# EAGLE design ArduEye (EAGLE 5.08)
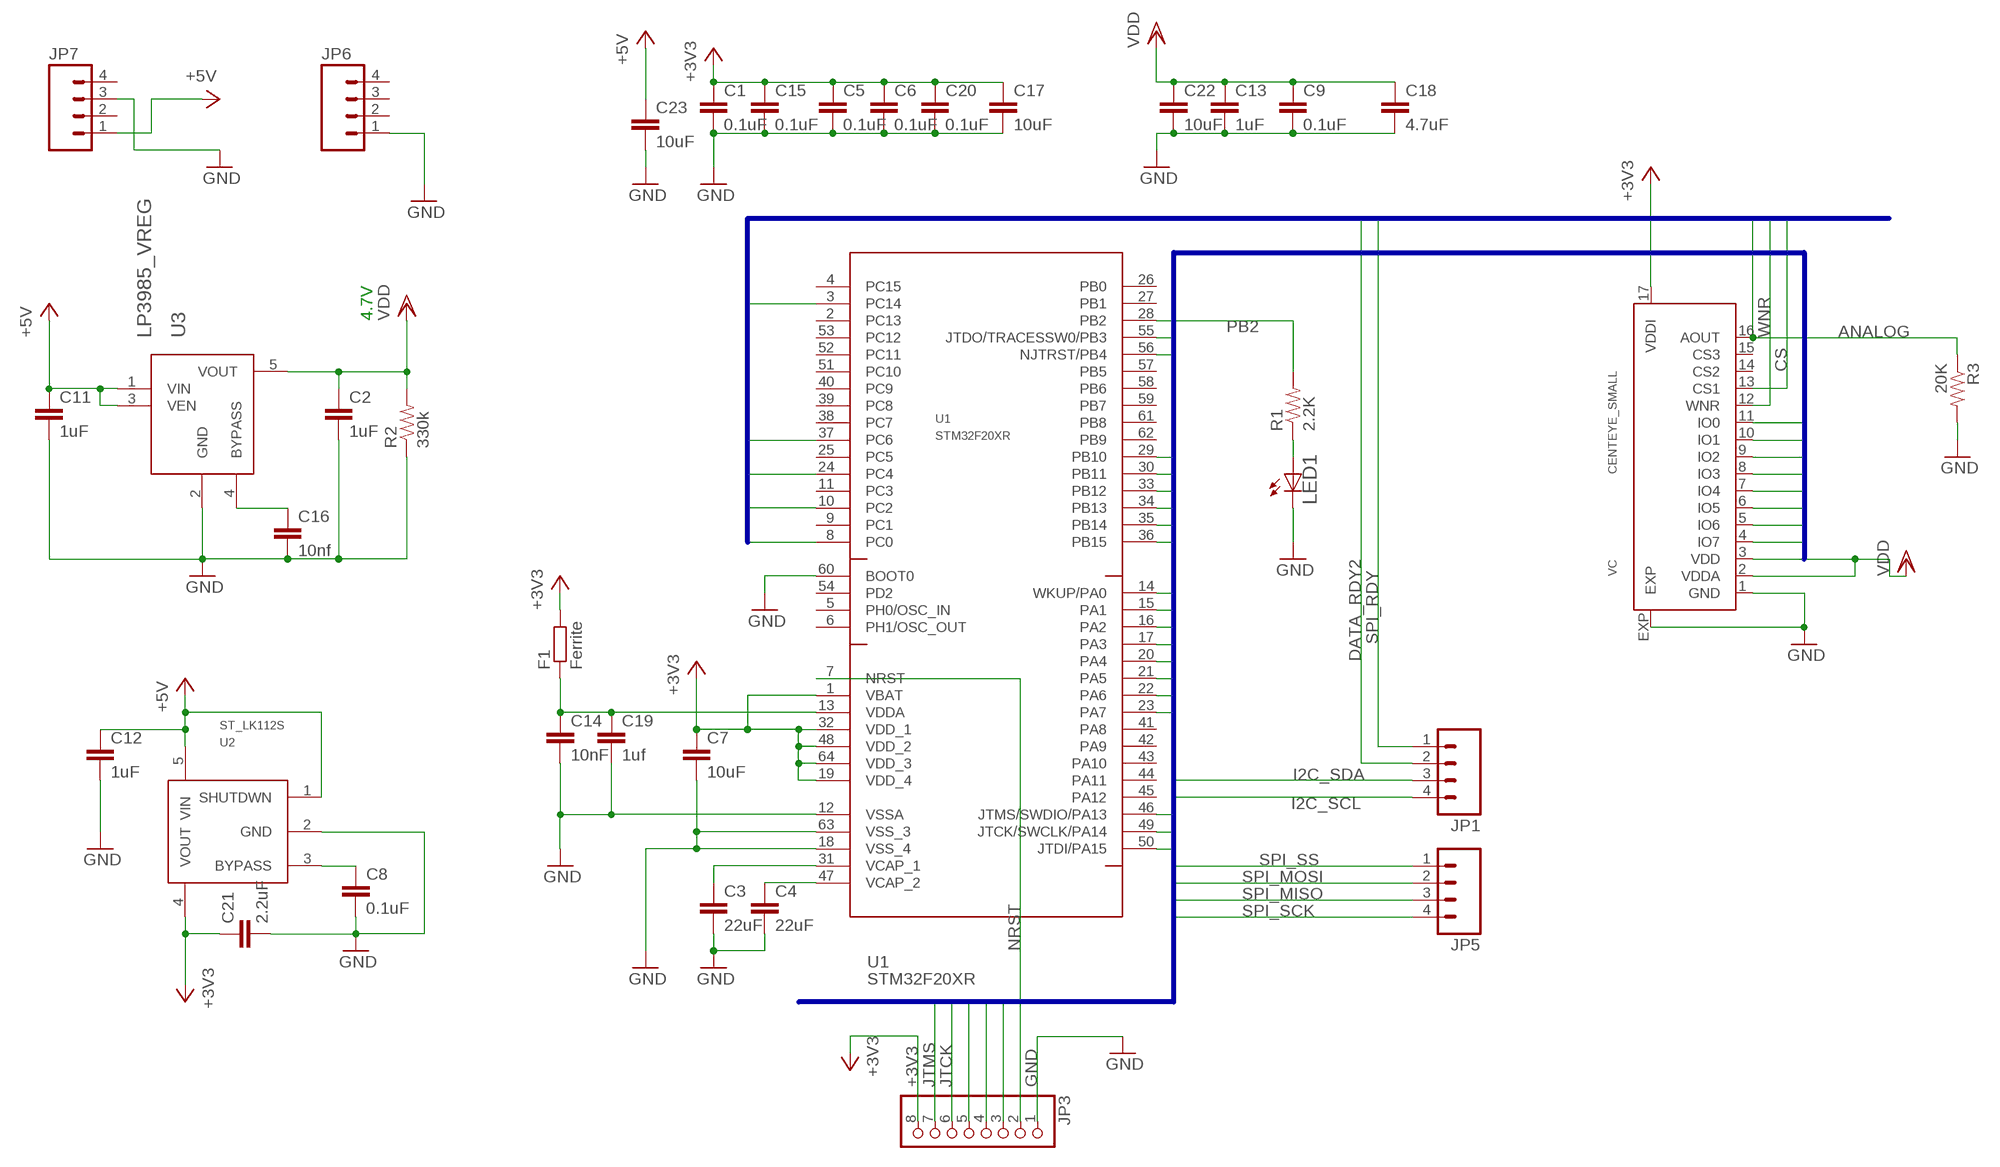
[diagram p0: schematic, sheet 1]

## Parts
C1  0.1uF  CAP0402-CAP  [0402-CAP]
C2  1uF  CAP0402-CAP  [0402-CAP]
C3  22uF  CAP0603-CAP  [0603-CAP]
C4  22uF  CAP0603-CAP  [0603-CAP]
C5  0.1uF  CAP0402-CAP  [0402-CAP]
C6  0.1uF  CAP0402-CAP  [0402-CAP]
C7  10uF  CAP0603-CAP  [0603-CAP]
C8  0.1uF  CAP0402-CAP  [0402-CAP]
C9  0.1uF  CAP0402-CAP  [0402-CAP]
C11  1uF  CAP0402-CAP  [0402-CAP]
C12  1uF  CAP0402-CAP  [0402-CAP]
C13  1uF  CAP0402-CAP  [0402-CAP]
C14  10nF  CAP0402-CAP  [0402-CAP]
C15  0.1uF  CAP0402-CAP  [0402-CAP]
C16  10nf  CAP0603-CAP  [0603-CAP]
C17  10uF  CAP0603-CAP  [0603-CAP]
C18  4.7uF  CAP0402-CAP  [0402-CAP]
C19  1uf  CAP0402-CAP  [0402-CAP]
C20  0.1uF  CAP0402-CAP  [0402-CAP]
C21  2.2uF  CAP0402-CAP  [0402-CAP]
C22  10uF  CAP0603-CAP  [0603-CAP]
C23  10uF  CAP0603-CAP  [0603-CAP]
F1  Ferrite  R-EU_R0402  [R0402]
JP1  M04PTH  [1X04]
JP3  PINHD-1X8/2MM  [1X08/2MM]
JP5  M04PTH  [1X04]
JP6  M04PTH  [1X04]
JP7  M04PTH  [1X04]
LED1  LEDCHIPLED_0805  [CHIPLED_0805]
R1  2.2K  RESISTOR0402-RES  [0402-RES]
R2  330k  RESISTOR0402-RES  [0402-RES]
R3  20K  RESISTOR0402-RES  [0402-RES]
U1  STM32F20XR  [LQFP64]
U2  ST_LK112S  [SOT23-5L]
U3  LP3985_VREG  [SOT-235]
VC  CENTEYE_SMALL  [CENTEYE_SMALL]

## Nets
+3V3: C1.1 C5.1 C6.1 C7.1 C15.1 C17.1 C20.1 C21.1 F1.2 JP3.8 U1.1(VBAT) U1.19(VDD_4) U1.32(VDD_1) U1.48(VDD_2) U1.64(VDD_3) U2.4(VOUT) VC.17(VDDI)
+5V: C11.1 C12.1 C23.1 JP7.1 U2.1(SHUTDWN) U2.5(VIN) U3.1(VIN) U3.3(VEN)
ANALOG: R3.1 U1.10(PC2) VC.16(AOUT)
CS: U1.8(PC0) VC.13(CS1)
DATA_RDY2: JP1.2 U1.24(PC4)
GND: C1.2 C2.2 C3.2 C4.2 C5.2 C6.2 C7.2 C8.2 C9.2 C11.2 C12.2 C13.2 C14.2 C15.2 C16.2 C17.2 C18.2 C19.2 C20.2 C21.2 C22.2 C23.2 JP3.1 JP6.1 JP7.3 LED1.C R2.1 R3.2 U1.12(VSSA) U1.18(VSS_4) U1.60(BOOT0) U1.63(VSS_3) U2.2(GND) U3.2(GND) VC.1(GND) VC.EXP
I2C_SCL: JP1.4 U1.29(PB10)
I2C_SDA: JP1.3 U1.30(PB11)
IO0: U1.14(WKUP/PA0) VC.11(IO0)
IO1: U1.15(PA1) VC.10(IO1)
IO2: U1.16(PA2) VC.9(IO2)
IO3: U1.17(PA3) VC.8(IO3)
IO4: U1.20(PA4) VC.7(IO4)
IO5: U1.21(PA5) VC.6(IO5)
IO6: U1.22(PA6) VC.5(IO6)
IO7: U1.23(PA7) VC.4(IO7)
JTCK: JP3.6 U1.49(JTCK/SWCLK/PA14)
JTDI: JP3.5 U1.50(JTDI/PA15)
JTDO: JP3.4 U1.55(JTDO/TRACESSW0/PB3)
JTMS: JP3.7 U1.46(JTMS/SWDIO/PA13)
N$1: C3.1 U1.31(VCAP_1)
N$2: C4.1 U1.47(VCAP_2)
N$7: C16.1 U3.4(BYPASS)
N$8: C8.1 U2.3(BYPASS)
N$13: C14.1 C19.1 F1.1 U1.13(VDDA)
N$15: LED1.A R1.1
NJTRST: JP3.3 U1.56(NJTRST/PB4)
NRST: JP3.2 U1.7(NRST)
PB2: R1.2 U1.28(PB2)
SPI_MISO: JP5.3 U1.35(PB14)
SPI_MOSI: JP5.2 U1.36(PB15)
SPI_RDY: JP1.1 U1.37(PC6)
SPI_SCK: JP5.4 U1.34(PB13)
SPI_SS: JP5.1 U1.33(PB12)
VDD: C2.1 C9.1 C13.1 C18.1 C22.1 R2.2 U3.5(VOUT) VC.2(VDDA) VC.3(VDD)
WNR: U1.3(PC14) VC.12(WNR)
Unconnected: JP6.2 JP6.3 JP6.4 JP7.2 JP7.4 U1.2(PC13) U1.4(PC15) U1.5(PH0/OSC_IN) U1.6(PH1/OSC_OUT) U1.9(PC1) U1.11(PC3) U1.25(PC5) U1.26(PB0) U1.27(PB1) U1.38(PC7) U1.39(PC8) U1.40(PC9) U1.41(PA8) U1.42(PA9) U1.43(PA10) U1.44(PA11) U1.45(PA12) U1.51(PC10) U1.52(PC11) U1.53(PC12) U1.54(PD2) U1.57(PB5) U1.58(PB6) U1.59(PB7) U1.61(PB8) U1.62(PB9) VC.14(CS2) VC.15(CS3)

## Buses
JTMS,JTCK,JTDI,IO[0..7],JTDO,NJTRST,SPI_MISO,SPI_MOSI,SPI_SS,SPI_SCK,PB2,I2C_SCL,I2C_SDA
CS,WNR,DATA_RDY2,SPI_RDY,ANALOG

## Notes on the sheet
- 4.7V

## Library data of the parts
C1-C9 C11-C23 = SparkFun:CAP: Capacitor Standard 0603 ceramic capacitor, and 0.1" leaded capacitor.
F1 = rcl:R-EU_: RESISTOR, European symbol
JP1 JP5-JP7 = SparkFun:M04: Header 4 Standard 4-pin 0.1" header. Use with straight break away headers (SKU : PRT-00116), right angle break away headers (PRT-00553), swiss pins (PRT-00743), machine pins (PRT-00117), and female headers (PRT-00115). Molex polarized connector foot print use with SKU : PRT-08231 with associated crimp pins and housings. 1MM SMD Version SKU: PRT-10208
JP3 = pinhead:PINHD-1X8: PIN HEADER
LED1 = led:LED: LED OSRAM: - CHIPLED LG R971, LG N971, LY N971, LG Q971, LY Q971, LO R971, LY R971 LH N974, LH R974 LS Q976, LO Q976, LY Q976 LO Q996 - Hyper CHIPLED LW Q18S LB Q993, LB Q99A, LB R99A - SideLED LS A670, LO A670, LY A670, LG A670, LP A670 LB A673, LV A673, LT A673, LW A673 LH A674 LY A675 LS A676, LA A676, LO A676, LY A676, LW A676 LS A679, LY A679, LG A679 - Hyper Micro SIDELED® LS Y876, LA Y876, LO Y876, LY Y876 LT Y87S - SmartLED LW L88C, LW L88S LB L89C, LB L89S, LG L890 LS L89K, LO L89K, LY L89K LS L896, LA L896, LO L896, LY L896 - TOPLED LS T670, LO T670, LY T670, LG T670, LP T670 LSG T670, LSP T670, LSY T670, LOP T670, LYG T670 LG T671, LOG T671, LSG T671 LB T673, LV T673, LT T673, LW T673 LH T674 LS T676, LA T676, LO T676, LY T676, LB T676, LH T676, LSB T676, LW T676 LB T67C, LV T67C, LT T67C, LS T67K, LO T67K, LY T67K, LW E67C LS E67B, LA E67B, LO E67B, LY E67B, LB E67C, LV E67C, LT E67C LW T67C LS T679, LY T679, LG T679 LS T770, LO T770, LY T770, LG T770, LP T770 LB T773, LV T773, LT T773, LW T773 LH T774 LS E675, LA E675, LY E675, LS T675 LS T776, LA T776, LO T776, LY T776, LB T776 LHGB T686 LT T68C, LB T68C - Hyper Mini TOPLED® LB M676 - Mini TOPLED Santana® LG M470 LS M47K, LO M47K, LY M47K Source: http://www.osram.convergy.de LUXEON: - LUMILED® LXK2-PW12-R00, LXK2-PW12-S00, LXK2-PW14-U00, LXK2-PW14-V00 LXK2-PM12-R00, LXK2-PM12-S00, LXK2-PM14-U00 LXK2-PE12-Q00, LXK2-PE12-R00, LXK2-PE12-S00, LXK2-PE14-T00, LXK2-PE14-U00 LXK2-PB12-K00, LXK2-PB12-L00, LXK2-PB12-M00, LXK2-PB14-N00, LXK2-PB14-P00, LXK2-PB14-Q00 LXK2-PR12-L00, LXK2-PR12-M00, LXK2-PR14-Q00, LXK2-PR14-R00 LXK2-PD12-Q00, LXK2-PD12-R00, LXK2-PD12-S00 LXK2-PH12-R00, LXK2-PH12-S00 LXK2-PL12-P00, LXK2-PL12-Q00, LXK2-PL12-R00 Source: www.luxeon.com KINGBRIGHT: KA-3528ASYC Source: www.kingbright.com
R1-R3 = SparkFun:RESISTOR: Resistor Basic schematic elements and footprints for 0603, 1206, and PTH resistors.
U1 = stm32F:STM32F20XR
U2 = VREGS:ST_LK112S
U3 = national-semiconductor:LP3985_VREG
VC = ty_custom2:CENTEYE_SMALL

## Board
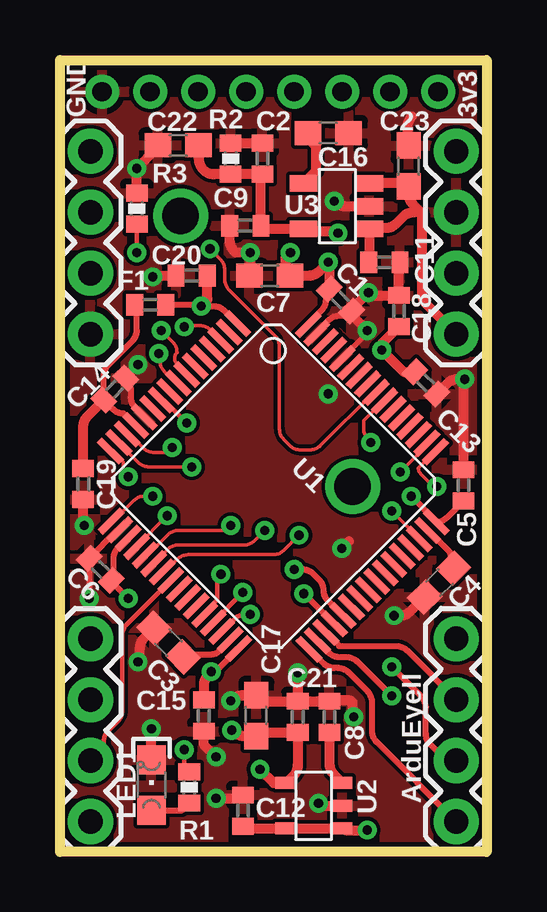
[diagram p1: board, top side]
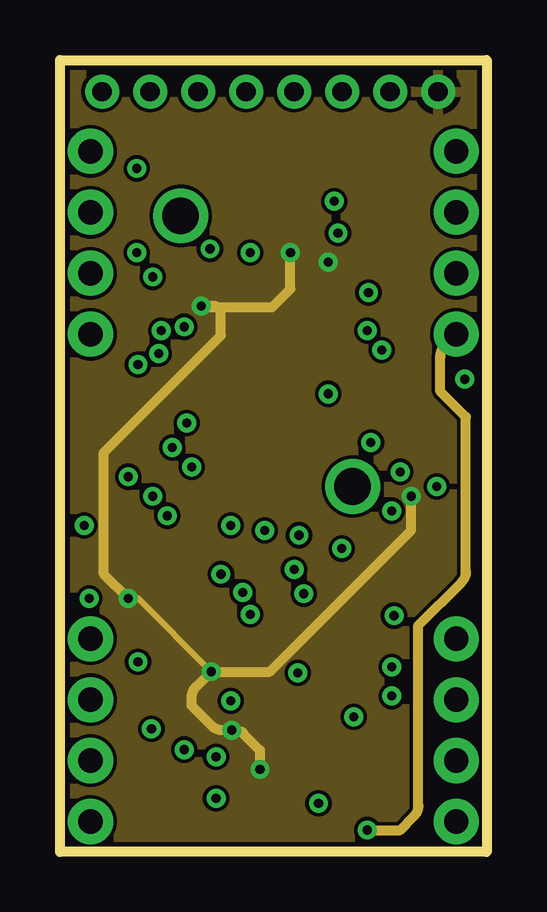
[diagram p2: board, inner layer Route2]
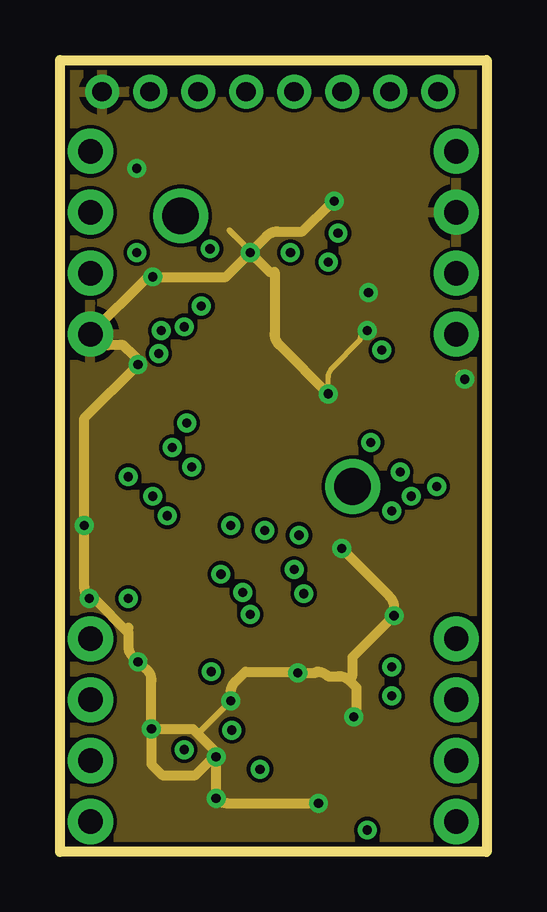
[diagram p3: board, inner layer Route15]
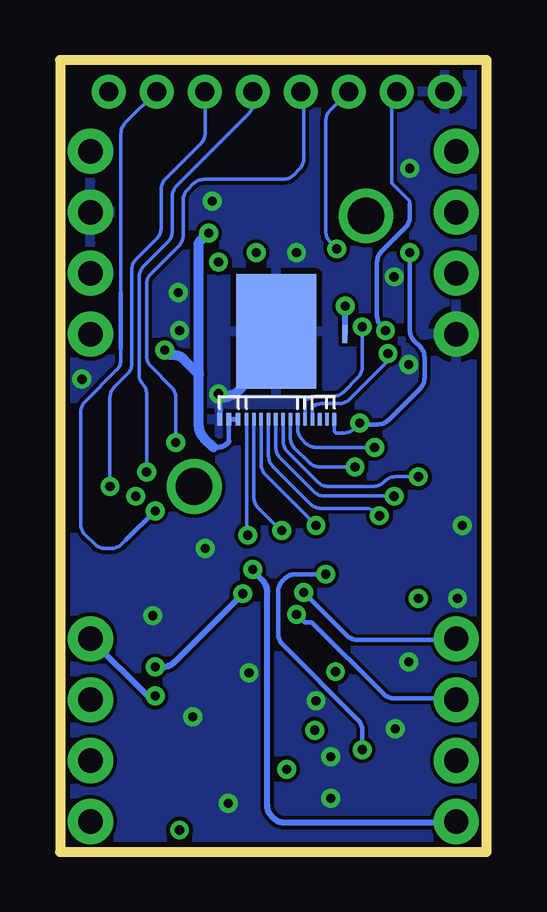
[diagram p4: board, bottom side, seen from below]

Size 17.78 x 33.02 mm. Coordinates in mm from the lower left corner, seen from the top.
Outline: 0,0 0,33.02 17.78,33.02 17.78,0 0,0
Copper layers (1*2*15*16): Top 0.035mm / dielectric 0.2mm / Route2 0.035mm / dielectric 0.2mm / Route15 0.035mm / dielectric 0.2mm / Bottom 0.035mm
Design rules "default *": minimum track width 6mil, minimum drill 15mil, track to track 6mil, track to pad 6mil, pad to pad 6mil, via to via 6mil, smd to smd 0mil, copper to edge 8mil, drill to drill 8mil, minimum pad ring 10mil, minimum via ring 8mil, stop-mask expansion 4mil, vias tented up to drill 20mil, thermal gap 10mil

### Footprints (pad centres in the part's own frame; a part is rotated, then mirrored left to right if it is on the bottom)
0402-CAP = smd 0.7 x 0.9: 1 -0.65,0; 2 0.65,0
0603-CAP = smd 1.1 x 1: 1 -0.85,0; 2 0.85,0
R0402 = smd 0.7 x 0.9: 1 -0.65,0; 2 0.65,0
1X04 = drill 1.016 pad 1.88 round: 1 0,0; 2 2.54,0; 3 5.08,0; 4 7.62,0
1X08/2MM = drill 0.8 pad 1.422 round: 1 -8,0; 2 -6,0; 3 -4,0; 4 -2,0; 5 0,0; 6 2,0; 7 4,0; 8 6,0
CHIPLED_0805 = smd 1.2 x 1.2: A 0,-1.05; C 0,1.05
0402-RES = smd 0.7 x 0.9: 1 -0.65,0; 2 0.65,0
LQFP64 = smd 1.3 x 0.3: 1 -5.85,3.75; 2 -5.85,3.25; 3 -5.85,2.75; 4 -5.85,2.25; 5 -5.85,1.75; 6 -5.85,1.25; 7 -5.85,0.75; 8 -5.85,0.25; 9 -5.85,-0.25; 10 -5.85,-0.75; 11 -5.85,-1.25; 12 -5.85,-1.75; 13 -5.85,-2.25; 14 -5.85,-2.75; 15 -5.85,-3.25; 16 -5.85,-3.75; 33 5.85,-3.75; 34 5.85,-3.25; 35 5.85,-2.75; 36 5.85,-2.25; 37 5.85,-1.75; 38 5.85,-1.25; 39 5.85,-0.75; 40 5.85,-0.25; 41 5.85,0.25; 42 5.85,0.75; 43 5.85,1.25; 44 5.85,1.75; 45 5.85,2.25; 46 5.85,2.75; 47 5.85,3.25; 48 5.85,3.75 | smd 0.3 x 1.3: 17 -3.75,-5.8; 18 -3.25,-5.8; 19 -2.75,-5.8; 20 -2.25,-5.8; 21 -1.75,-5.8; 22 -1.25,-5.8; 23 -0.75,-5.8; 24 -0.25,-5.8; 25 0.25,-5.8; 26 0.75,-5.8; 27 1.25,-5.8; 28 1.75,-5.8; 29 2.25,-5.8; 30 2.75,-5.8; 31 3.25,-5.8; 32 3.75,-5.8; 49 3.75,5.8; 50 3.25,5.8; 51 2.75,5.8; 52 2.25,5.8; 53 1.75,5.8; 54 1.25,5.8; 55 0.75,5.8; 56 0.25,5.8; 57 -0.25,5.8; 58 -0.75,5.8; 59 -1.25,5.8; 60 -1.75,5.8; 61 -2.25,5.8; 62 -2.75,5.8; 63 -3.25,5.8; 64 -3.75,5.8
SOT23-5L = smd 0.5 x 0.8: 1 0.95,1.15; 2 0,1.15; 3 -0.95,1.15; 4 -0.95,-1.25; 5 0.95,-1.25
SOT-235 = smd 0.686 x 1.143: 1 -0.953,-0.953; 2 0,-0.953; 3 0.953,-0.953; 4 0.953,1.791; 5 -0.953,1.791
CENTEYE_SMALL = smd 0.203 x 0.508: 1 -1.981,-1.01; 2 -1.6,-1.008; 3 -1.219,-1.008 | smd 0.152 x 0.508: 4 -0.864,-1.008; 5 -0.559,-1.008; 6 -0.254,-1.008; 7 0.051,-1.008; 8 0.356,-1.008; 9 0.66,-1.008; 10 0.965,-1.008; 11 1.27,-1.005; 12 1.575,-1.008; 13 1.88,-1.008; 14 2.184,-1.008; 15 2.489,-1.007; 16 2.794,-1.007 | smd 0.203 x 0.762: 17 3.229,2.546 | smd 3.327 x 4.775: EXP 0.381,2.654

### Placement (x,y rotation side)
C1  11.68,23.01 315 top
C2  8.43,28.91 90 top
C3  4.52,8.74 135 top
C4  15.8,11.23 225 top
C5  16.81,15.29 90 top
C6  1.68,11.79 135 top
C7  8.74,24.03 180 top
C8  11.23,5.64 90 top
C9  7.72,26.11 180 top
C11  13.51,24.59 0 top
C12  7.62,1.73 90 top
C13  15.24,19.56 315 top
C14  2.29,19.3 45 top
C15  5.99,5.69 270 top
C16  11.18,29.97 0 top
C17  8.18,5.69 90 top
C18  14.12,22.56 90 top
C19  0.97,15.34 270 top
C20  5.49,24.03 180 top
C21  9.91,5.64 90 top
C22  4.93,29.46 180 top
C23  14.53,28.6 90 top
F1  3.76,22.81 0 top
JP1  1.27,1.27 90 top
JP3  9.75,31.7 0 top
JP5  16.51,1.27 90 top
JP6  1.27,21.59 90 top
JP7  16.51,21.59 90 top
LED1  3.81,2.79 0 top
R1  5.38,2.69 90 top
R2  7.11,28.91 270 top
R3  3.2,26.82 90 top
U1  8.89,15.24 315 top
U2  10.62,1.93 270 top
U3  11.94,26.92 90 top
VC  9.14,19.05 0 bottom

### Tracks (layer width: path | path; a pad name or v marks a point on that pad's centre or on a via)
+3V3  (via drill 0.38)
  Top 0.254: v6.3,7.52 arc45 6.59,7.64 U1.32 | U1.19 arc45 2.81,13.07 2.42,12.68 arc45 2.23,12.23 2.23,11.56 arc-45 C6.1 arc45 2.17,11.24 v2.85,10.57 | C5.1 16.11,13.93 arc-45 U1.48 15.68,13.79 v14.63,14.83 | U1.64 arc-45 10.36,22.05 10.89,22.57 arc45 11.07,23.02 11.07,23.11 arc-45 C1.1 | U1.1 arc-45 7.37,22.04 6.84,22.57 arc45 6.39,22.76 6.1,22.76 | F1.2 5.77,22.81 arc-45 v5.89,22.76
  Top 0.406: C15.1 5.99,6.95 arc-45 6.18,7.4 v6.3,7.52 | C20.1 6.14,23.06 arc-45 6.1,22.96 6.1,22.76 v5.89,22.76 | C1.1 11.22,24.47 arc45 v11.18,24.59 10.8,24.21 arc-45 10.35,24.03 C7.1 9.57,24.04 arc-45 9.39,24.49 9.39,24.78 v9.6,24.99 | U2.4 8.9,2.88 v8.33,3.45 | 9.45,2.9 9.72,3.17 arc45 9.91,3.62 C21.1 8.3,4.99 arc-45 C17.1 7.67,4.84 arc-45 7.22,5.03 v7.16,5.08
  Route2 0.254: v6.3,7.52 3.23,10.58 2.86,10.58 v2.85,10.57
  Route2 0.406: v14.63,14.83 14.63,13.41 8.74,7.52 v6.3,7.52 5.67,6.89 arc45 5.49,6.44 5.49,6.1 6.32,5.27 arc45 6.76,5.08 v7.16,5.08 7.21,5.03 7.57,5.03 7.62,4.98 7.62,4.95 8.33,4.24 v8.33,3.45 | v2.85,10.57 1.83,11.58 1.83,16.66 6.71,21.54 6.71,22.55 6.5,22.76 v5.89,22.76 | v9.6,24.99 9.6,23.47 8.84,22.71 5.94,22.71
  Bottom 0.254: VC.17 5.92,22.7 arc45 v5.89,22.76
  pour Route2: 0,33.02 17.68,33.02 17.68,0 0,0
+5V  (via drill 0.38)
  Top 0.406: 15.04,26.67 14.74,26.67 arc45 14.29,26.48 14,26.2 arc-45 13.55,26.01 12.98,26.01 arc45 U3.1 12.89,24.65 arc-45 C11.1 | C12.1 arc45 7.85,0.98 U2.5 U2.1 arc45 11.93,0.91 v12.8,0.91 | 15.04,26.67 14.71,26.99 arc-45 14.53,27.44 C23.1 arc-45 14.35,27.88 U3.3 | 15.04,26.67 15.04,26.64 arc45 15.09,26.52 15.09,23.27 arc45 15.27,22.83 JP7.1
  Route2 0.406: v12.8,0.91 14.17,0.91 14.75,1.49 arc45 14.94,1.94 14.94,9.45 16.73,11.24 arc45 16.92,11.69 16.92,18.14 15.85,19.2 15.85,20.67 arc-45 16.04,21.12 JP7.1
ANALOG  (via drill 0.38)
  Top 0.178: U1.10 4.32,18.85 v5.28,17.88 | v3.2,24.99 R3.1
  Bottom 0.152: v5.28,17.88 5.33,17.83 5.5,17.66 arc45 5.95,17.48 6.3,17.48 arc45 6.35,17.6 VC.16
  Bottom 0.178: 5.33,17.83 4.53,17.83 arc-45 4.08,18.02 2.78,19.32 arc-45 2.59,19.77 2.59,20.62 arc-45 2.78,21.07 3.01,21.3 arc45 3.2,21.75 v3.2,24.99
CS  (via drill 0.38)
  Top 0.152: v4.12,20.78 4.17,20.73 4.17,20.48 arc45 4.35,20.03 4.57,19.81 4.83,19.55 U1.8
  Bottom 0.152: VC.13 7.26,18.54 arc45 6.9,18.69 6.16,18.69 arc-45 5.71,18.88 4.12,20.47 v4.12,20.78
DATA_RDY2
  Top 0.178: 4.57,11.28 2.78,9.48 arc45 2.59,9.03 2.59,5.9 arc-45 2.4,5.45 2,5.05 arc45 1.83,4.63 arc-45 1.64,4.18 JP1.2
  Top 0.254: 4.57,11.28 U1.24
GND  (via drill 0.38)
  Top 0.203: v12.8,21.74 arc-45 12.73,21.57 12.19,21.03 arc-45 12.18,21.01 U1.60
  Top 0.254: U1.18 arc45 2.35,13.38 C6.2 1.22,10.98 arc45 v1.22,10.57 | C1.2 12.13,22.54 arc-45 11.68,22.35 11.64,22.35 arc45 11.19,22.17 10.71,21.68 10.71,21.66 U1.63 | U1.12 arc-45 3.49,18.15 3.13,18.51 arc-45 2.95,18.96 2.95,19.3 arc45 2.76,19.75 C14.2
  Top 0.406: v3.25,7.92 arc45 3.33,7.96 3.33,8.48 arc-45 3.52,8.93 C3.2 | U2.2 11.02,1.93 arc-45 v10.77,2.03 | v6.5,2.23 7.28,2.23 arc45 C12.2 | C21.2 C8.2 | C21.2 8.3,6.29 arc-45 C17.2 7.62,6.54 arc45 7.17,6.35 v7.11,6.3 | 11.43,6.3 11.45,6.32 12.03,6.32 arc-45 12.19,6.25 12.19,5.76 arc45 v12.24,5.64 | LED1.C 3.81,4.75 arc-45 v3.81,5.13 | R2.1 C2.2 | C19.2 0.96,13.74 arc45 v1.02,13.61 | C1.2 arc45 12.22,22.59 12.22,22.69 v12.85,23.32 arc45 13.12,23.2 C18.2 14.12,24.49 arc-45 C11.2 14.22,24.59 | 12.13,22.54 arc45 12.22,22.33 v12.8,21.74 | C14.2 arc-45 2.78,19.85 v3.25,20.32 | C9.2 7.07,25.5 arc45 7.26,25.05 7.32,24.99 v7.92,24.99 7.92,24.42 arc45 C7.2 | C13.2 16.13,19.52 arc-45 16.57,19.71 v16.87,19.71 arc45 16.82,19.59 C5.2 | C20.2 3.91,24.03 v3.86,23.98 | R3.2 v3.2,28.5 4.01,29.31 arc45 C22.2 | C15.2 5.99,4.47 v6.5,3.96 | v11.73,12.65 12.04,12.95 | v13.92,9.86 14.16,9.86 arc45 14.61,10.04 C4.2 | v9.91,7.47 C21.2 | 14.48,29.41 14.48,30.22 arc-45 14.66,30.67 | U3.2 11.9,26.92 arc-45 11.45,27.11 v11.43,27.13
  Route15 0.203: v11.18,19.1 11.18,19.75 arc-45 11.36,20.2 12.5,21.34 arc-45 12.57,21.51 v12.8,21.74
  Route15 0.254: v7.92,24.99 arc45 7.88,25.1 7.07,25.91 | v1.22,10.57 1.42,10.57 | 5.69,4.88 v7.11,6.3
  Route15 0.406: 2.85,9.14 2.85,8.59 arc45 3.03,8.14 v3.25,7.92 | 2.85,9.14 2.85,9.35 | v10.77,2.03 6.97,2.03 arc-45 6.52,2.22 v6.5,2.23 v6.5,3.96 | v7.11,6.3 7.11,6.65 arc-45 7.3,7.09 7.72,7.52 9.78,7.52 arc-45 v9.91,7.47 10.59,7.47 arc45 10.71,7.52 arc-45 11.16,7.33 11.61,7.33 arc-45 12.06,7.15 | v3.81,5.13 3.81,7.15 arc45 3.62,7.6 3.35,7.87 3.35,7.92 3.43,8 | v1.22,10.57 1.2,10.58 arc-45 1.02,11.03 v1.02,13.61 1.02,18.09 v3.25,20.32 arc45 3.11,20.67 2.64,21.13 1.99,21.13 arc-45 1.54,21.32 JP6.1 3.66,23.98 v3.86,23.98 6.91,23.98 v7.92,24.99 | v11.18,19.1 9.13,21.15 arc-45 8.94,21.6 8.94,24.18 8.74,24.18 v7.92,24.99 | v16.87,19.71 16.7,19.88 | 1.42,10.57 2.85,9.14 | v3.81,5.13 5.54,5.13 6.48,4.19 | v3.2,28.5 3.2,28.39 | 6.5,4.01 6.45,4.01 5.64,3.2 4.27,3.2 3.81,3.66 v3.81,5.13 | v11.73,12.65 13.73,10.65 arc-45 13.92,10.2 v13.92,9.86 12.19,8.13 12.19,7.47 arc-45 12.06,7.15 | 12.06,7.15 12.34,6.86 12.34,5.88 arc-45 v12.24,5.64 | v11.43,27.13 arc45 11.31,27.08 10.1,25.87 9.06,25.87 arc45 8.61,25.68 v7.92,24.99
  Bottom 0.203: VC.1 11.12,18.98 arc-45 v11.18,19.1
  Bottom 0.406: 10.21,19.81 10.21,19.36 10.41,19.16 arc45 10.67,19.05 arc45 10.84,18.98 11.12,18.98
  pour Route15: 0,33.02 17.78,33.02 17.78,0 0,0
  pour Top: 0,32.92 17.68,32.92 17.68,32.11 17.68,0.2 0.2,0.2 0,0.2 0,32.72
  pour Bottom: 0,32.77 17.53,32.77 17.53,0 0,0
I2C_SCL  (via drill 0.38)
  Top 0.178: U1.29 6.38,9.58 v7.62,10.82
  Bottom 0.178: v7.62,10.82 5.83,9.03 arc-45 5.38,8.84 1.32,8.84 JP1.4
I2C_SDA  (via drill 0.38)
  Top 0.178: U1.30 arc45 6.77,9.21 7.28,9.72 arc-45 7.73,9.91 v7.92,9.91
  Bottom 0.178: JP1.3 arc-45 1.39,6.4 3.85,6.4 arc45 4.3,6.59 7.28,9.57 7.59,9.57 v7.92,9.91
IO0  (via drill 0.38)
  Top 0.152: U1.14 2.89,17.43 3.47,16.85 arc45 3.92,16.66 4.47,16.66 v4.67,16.87
  Bottom 0.152: VC.11 7.87,17.64 arc-45 7.69,17.19 7.55,17.05 arc-45 7.1,16.87 v4.67,16.87
IO1  (via drill 0.38)
  Top 0.152: U1.15 2.46,17.05 3.27,16.24 arc45 3.72,16.05 v5.49,16.05
  Bottom 0.152: VC.10 8.18,17.28 arc-45 7.99,16.83 7.4,16.24 arc-45 6.95,16.05 v5.49,16.05
IO2  (via drill 0.38)
  Top 0.152: U1.16 2.17,16.73 2.64,16.26 2.64,15.85 v2.85,15.65
  Bottom 0.152: v2.85,15.65 3.8,15.65 arc-45 4.25,15.46 4.28,15.43 arc45 4.73,15.24 6.59,15.24 arc45 7.04,15.43 8.3,16.68 arc45 8.48,17.13 VC.9
IO3  (via drill 0.38)
  Top 0.152: U1.17 2.21,13.79 3.06,14.65 arc-45 3.51,14.83 v3.86,14.83
  Bottom 0.152: VC.8 8.79,16.88 arc-45 8.6,16.43 7.2,15.02 arc-45 6.75,14.83 v3.86,14.83
IO4  (via drill 0.38)
  Top 0.152: U1.20 3.2,12.75 v4.47,14.02
  Bottom 0.152: VC.7 9.09,16.52 arc-45 8.91,16.07 7.35,14.51 arc-45 6.9,14.33 5.04,14.33 arc45 4.59,14.14 v4.47,14.02
IO5  (via drill 0.38)
  Top 0.152: U1.21 3.64,12.38 4.49,13.22 arc-45 4.94,13.41 6.91,13.41 v7.11,13.61
  Bottom 0.152: v7.11,13.61 9.21,15.71 arc45 9.4,16.16 VC.6
IO6  (via drill 0.38)
  Top 0.152: U1.22 3.9,12.03 4.49,12.62 arc-45 4.94,12.8 7.66,12.8 arc45 8.11,12.99 v8.53,13.41
  Bottom 0.152: v8.53,13.41 8.59,13.41 9.52,14.34 arc45 9.7,14.79 VC.5
IO7  (via drill 0.38)
  Top 0.152: U1.23 4.35,11.67 4.89,12.21 arc-45 5.34,12.39 8.88,12.39 arc45 9.33,12.58 v9.96,13.21
  Bottom 0.152: v9.96,13.21 9.96,13.36 10.01,13.41 VC.4
JTCK  (via drill 0.38)
  Top 0.152: U1.49 arc45 15.61,16.68 14.94,16 arc45 15.04,15.74 15.54,15.24 v15.7,15.24
  Bottom 0.152: v15.7,15.24 15.7,18.94 arc45 15.51,19.39 14.97,19.93 arc-45 14.78,20.38 14.78,24.27 arc45 14.6,24.72 13.75,25.57 arc-45 13.56,26.02 13.56,27.63 arc45 13.38,28.07 11.92,29.53 arc-45 11.73,29.98 11.73,31.65 | 11.73,31.65 arc-45 JP3.6 arc45 11.73,31.65
JTDI  (via drill 0.38)
  Top 0.152: U1.50 arc-45 15.23,16.91 v14.17,15.85
  Bottom 0.152: v14.17,15.85 14.17,19.09 arc-45 14.36,19.54 arc45 14.48,19.83 14.48,23.97 arc45 14.29,24.42 13.29,25.42 arc-45 13.11,25.87 13.11,27.32 arc45 12.92,27.77 9.94,30.75 arc-45 9.75,31.2 JP3.5
JTDO  (via drill 0.38)
  Top 0.152: U1.55 arc45 13.45,18.78 12.65,17.98 12.65,17.64 arc45 12.84,17.19 v12.95,17.07
  Bottom 0.152: v12.95,17.07 12.95,18.94 arc-45 13.14,19.39 13.99,20.24 arc45 14.17,20.68 14.17,23.66 arc45 13.99,24.11 12.84,25.27 arc-45 12.65,25.71 12.65,27.17 arc45 12.46,27.62 12.23,27.86 arc45 11.78,28.04 8.49,28.04 arc-45 8.04,28.23 7.81,28.46 arc-45 7.62,28.91 7.62,31.38 arc-45 JP3.4
JTMS  (via drill 0.38)
  Top 0.152: U1.46 14.97,13.07 v13.82,14.22
  Bottom 0.152: 15.24,23.31 15.24,29.95 arc45 15.05,30.4 JP3.7 | 15.04,13.01 15.21,12.84 arc45 15.65,12.65 15.89,12.65 arc45 16.34,12.84 16.73,13.22 arc45 16.92,13.67 16.92,18.33 arc45 16.73,18.78 15.43,20.08 arc-45 15.24,20.53 15.24,20.99
  Bottom 0.178: v13.82,14.22 15.04,13.01 | 15.24,20.99 15.24,23.31
N$1
  Top 0.254: U1.31 arc-45 7.07,8.79 6.69,8.42 arc-45 6.24,8.23 5.24,8.23
  Top 0.406: C3.1 arc45 5.16,8.15 5.24,8.23
N$2
  Top 0.254: U1.47 arc-45 15.37,13.38 16.26,12.5 arc45 16.4,12.16
  Top 0.406: 16.4,12.16 C4.1 arc45 C4.1
N$3  (via drill 1.52)
  other vias: 12.19,15.24
N$7
  Top 0.406: C16.1 10.33,29.75 10.67,29.41 10.67,28.4 U3.4
N$8
  Top 0.406: C8.1 11.23,3.68 arc45 11.41,3.23 U2.3
N$9  (via drill 1.52)
  other vias: 5.03,26.52
N$13
  Top 0.254: U1.13 arc-45 3.13,17.8 2.64,18.29 arc-45 2.2,18.47 C14.1 1.83,19.85 arc-45 2.02,20.3 3.01,21.3 arc45 3.2,21.75 3.2,22.66
  Top 0.406: C19.1 0.96,17.72 arc-45 1.15,18.17 C14.1 | 3.2,22.66 3.2,22.72 F1.1
N$15
  Top 0.254: LED1.A 5.09,1.74 R1.1
NJTRST  (via drill 0.38)
  Top 0.152: U1.56 13.07,19.16 10.85,16.95 arc-45 10.4,16.76 10.02,16.76 arc-45 9.57,16.95 9.33,17.19 arc-45 9.14,17.64 9.14,21.07 arc45 8.96,21.52 7.04,23.44 arc-45 6.86,23.89 6.86,24.27 arc45 6.67,24.72 v6.25,25.15
  Bottom 0.152: JP3.3 6.52,30.93 arc-45 6.71,30.48 6.71,25.87 arc-45 6.52,25.42 v6.25,25.15
NRST  (via drill 0.38)
  Top 0.152: U1.7 5.28,19.96 4.85,20.39 arc-45 4.78,20.58 arc-45 4.88,20.83 arc45 4.7,21.26 v4.22,21.74
  Bottom 0.152: 3.2,27.02 arc-45 3.28,27.2 3.96,27.89 3.96,31.23 arc45 3.78,31.68 JP3.2
  Bottom 0.178: 3.2,27.02 3.2,26.48 arc45 3.39,26.03 4.39,25.03 arc-45 4.57,24.58 4.57,22.36 arc-45 4.39,21.91 v4.22,21.74
PB2  (via drill 0.38)
  Top 0.178: U1.28 6.03,9.99 6.55,10.52 6.55,11.21 arc-45 v6.71,11.58 | v5.18,4.27 5.18,3.55 R1.2
  Bottom 0.178: 8.08,11.58 v6.71,11.58 7.97,11.58 arc-45 8.42,11.4 8.5,11.31 arc-45 8.69,10.86 8.69,9.1 arc-45 8.5,8.65 5.37,5.52 arc45 5.18,5.07 v5.18,4.27
SPI_MISO
  Top 0.254: U1.35 11.08,9.14 11.63,8.59 14.01,8.59 arc-45 14.46,8.4 JP5.3
SPI_MOSI  (via drill 0.38)
  Top 0.254: JP5.2 16.37,3.81 arc-45 15.92,4 15.43,4.49 arc-45 15.24,4.94 15.24,6.04 arc45 15.05,6.49 v13.82,7.72 | v10.16,10.77 10.18,10.77 U1.36
  Bottom 0.254: v13.82,7.72 13.47,7.72 arc-45 13.02,7.91 v10.16,10.77
SPI_RDY  (via drill 0.38)
  Top 0.254: v9.75,11.79 10.1,11.79 arc-45 10.55,11.6 10.79,11.36 arc-45 10.97,10.91 arc45 11.15,10.49 11.78,9.87 U1.37
  Bottom 0.254: v9.75,11.79 9.75,11.73 9.33,11.31 arc45 9.14,10.86 9.14,1.94 arc-45 8.96,1.49 8.87,1.41 arc-45 8.42,1.22 1.32,1.22 JP1.1
SPI_SCK  (via drill 0.38)
  Top 0.254: v13.82,6.5 12.38,7.94 arc45 11.93,8.13 11.64,8.13 arc-45 11.19,8.31 10.73,8.78 U1.34
  Bottom 0.254: v13.82,6.5 14.12,6.5 JP5.4
SPI_SS
  Top 0.254: U1.33 10.39,8.45 10.99,7.86 arc45 11.44,7.67 11.57,7.67 arc-45 12.02,7.49 12.82,6.69 arc-45 13.01,6.24 13.01,5.04 arc45 13.19,4.59 JP5.1
VDD  (via drill 0.38)
  Top 0.406: C9.1 arc45 8.43,26.06 | C9.1 arc-45 8.53,25.97 | v11.58,25.81 arc45 11.47,25.85 10.15,25.85 U3.5 8.51,25.97 C9.1 | C18.1 13.41,21.19 v13.41,20.93 14.32,20.02 C13.1 | C9.1 8.37,28.19 C2.1 R2.2 6.43,28.25 arc-90 5.79,28.89 5.79,29.43 arc45 C22.1
  Bottom 0.178: 10.74,17.13 VC.2
  Bottom 0.203: VC.2 VC.3 | 11.38,16.87 11.24,16.87 arc-45 10.79,17.05 10.77,17.07 arc-45 10.74,17.13
  Bottom 0.406: 11.99,19.91 11.99,17.74 arc-45 11.8,17.29 11.38,16.87 | v11.58,25.81 11.99,25.4 11.99,19.91 | 11.99,19.91 12.62,20.54 arc-45 13.06,20.73 13.21,20.73 v13.41,20.93
WNR  (via drill 0.38)
  Top 0.152: v5.18,21.89 5.23,21.95 5.83,21.95 arc-45 6.28,21.76 6.7,21.34 U1.3
  Bottom 0.152: VC.12 7.57,18.77 arc45 7.55,18.81 arc45 7.1,19 6.41,19 arc-45 5.96,19.18 5.37,19.78 arc-45 5.18,20.23 v5.18,21.89

### Text on the board
tPlace: GND | 3v3 | ArduEyeII